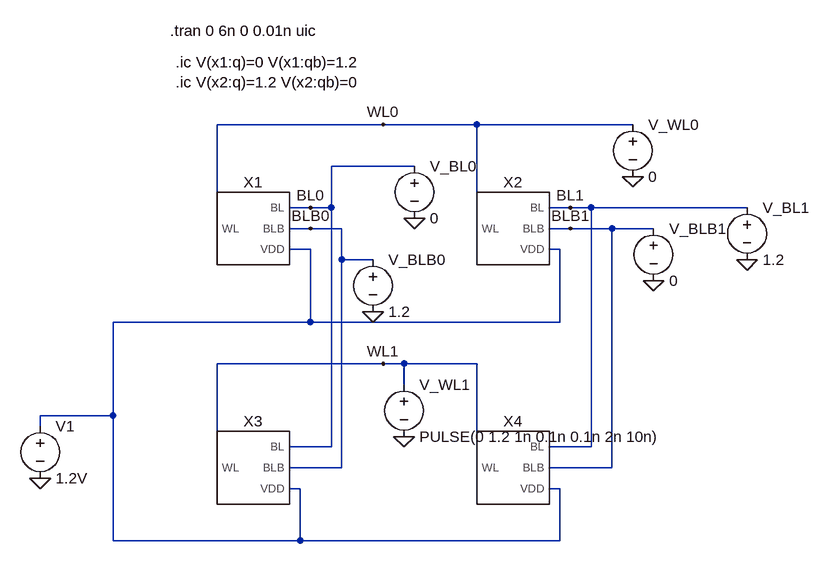
[diagram p0: schematic 2x2_SRAM_ARRAY.asc]
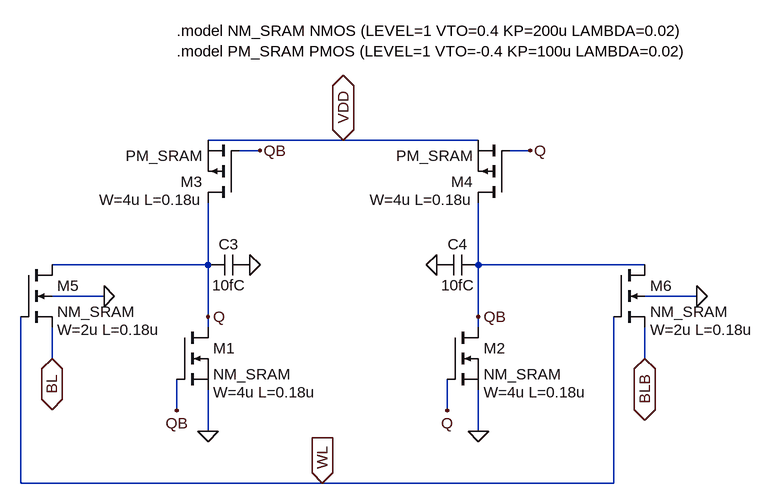
[diagram p1: sub-circuit sram_cell.asc]
2x2_SRAM_ARRAY.asc, the LTspice schematic file:
Version 4.1
SHEET 1 1124 680
WIRE 320 -32 64 -32
WIRE 464 -32 320 -32
WIRE 704 -32 464 -32
WIRE 368 32 240 32
WIRE 208 96 176 96
WIRE 240 96 240 32
WIRE 240 96 208 96
WIRE 608 96 576 96
WIRE 640 96 608 96
WIRE 880 96 640 96
WIRE 64 128 64 -32
WIRE 208 128 176 128
WIRE 256 128 208 128
WIRE 464 128 464 -32
WIRE 608 128 576 128
WIRE 672 128 608 128
WIRE 736 128 672 128
WIRE 208 160 176 160
WIRE 592 160 576 160
WIRE 256 176 256 128
WIRE 304 176 256 176
WIRE 208 272 208 160
WIRE 208 272 -96 272
WIRE 592 272 592 160
WIRE 592 272 208 272
WIRE 320 336 64 336
WIRE 352 336 320 336
WIRE 464 336 352 336
WIRE 352 368 352 336
WIRE -96 416 -96 272
WIRE -96 416 -208 416
WIRE -208 432 -208 416
WIRE 240 464 240 96
WIRE 240 464 176 464
WIRE 640 464 640 96
WIRE 640 464 576 464
WIRE 64 496 64 336
WIRE 256 496 256 176
WIRE 256 496 176 496
WIRE 464 496 464 336
WIRE 672 496 672 128
WIRE 672 496 576 496
WIRE 192 528 176 528
WIRE 592 528 576 528
WIRE -96 608 -96 416
WIRE 192 608 192 528
WIRE 192 608 -96 608
WIRE 592 608 592 528
WIRE 592 608 192 608
FLAG -208 512 0
FLAG 320 -32 WL0
FLAG 320 336 WL1
FLAG 208 96 BL0
FLAG 608 96 BL1
FLAG 208 128 BLB0
FLAG 608 128 BLB1
FLAG 704 48 0
FLAG 352 448 0
FLAG 368 112 0
FLAG 304 256 0
FLAG 736 208 0
FLAG 880 176 0
SYMBOL SRAM_Cell 112 128 R0
SYMATTR InstName X1
SYMBOL SRAM_Cell 512 128 R0
SYMATTR InstName X2
SYMBOL SRAM_Cell 112 496 R0
SYMATTR InstName X3
SYMBOL SRAM_Cell 512 496 R0
SYMATTR InstName X4
SYMBOL voltage -208 416 R0
SYMATTR InstName V1
SYMATTR Value 1.2V
SYMBOL voltage 704 -48 R0
WINDOW 123 0 0 Left 0
WINDOW 39 0 0 Left 0
SYMATTR InstName V_WL0
SYMATTR Value 0
SYMBOL voltage 352 352 R0
WINDOW 123 0 0 Left 0
WINDOW 39 0 0 Left 0
SYMATTR InstName V_WL1
SYMATTR Value PULSE(0 1.2 1n 0.1n 0.1n 2n 10n)
SYMBOL voltage 880 80 R0
SYMATTR InstName V_BL1
SYMATTR Value 1.2
SYMBOL voltage 736 112 R0
SYMATTR InstName V_BLB1
SYMATTR Value 0
SYMBOL voltage 368 16 R0
SYMATTR InstName V_BL0
SYMATTR Value 0
SYMBOL voltage 304 160 R0
SYMATTR InstName V_BLB0
SYMATTR Value 1.2
TEXT -8 -176 Left 2 !.tran 0 6n 0 0.01n uic
TEXT 0 -128 Left 2 !.ic V(x1:q)=0 V(x1:qb)=1.2\n.ic V(x2:q)=1.2 V(x2:qb)=0

sram_cell.asc, the sub-circuit schematic file:
Version 4.1
SHEET 1 3332 820
WIRE 256 -48 48 -48
WIRE 464 -48 256 -48
WIRE 128 -32 96 -32
WIRE 544 -32 512 -32
WIRE 48 144 48 48
WIRE 48 144 -192 144
WIRE 464 144 464 48
WIRE 720 144 464 144
WIRE -112 192 -192 192
WIRE 800 192 720 192
WIRE 48 224 48 144
WIRE 464 224 464 144
WIRE 48 240 48 224
WIRE 464 240 464 224
WIRE -192 288 -192 240
WIRE 720 288 720 240
WIRE 0 368 0 320
WIRE 416 368 416 320
WIRE 48 400 48 336
WIRE 464 400 464 336
WIRE -240 480 -240 224
WIRE 224 480 -240 480
WIRE 672 480 672 224
WIRE 672 480 224 480
FLAG 48 400 0
FLAG 464 400 0
FLAG 48 224 Q
FLAG 464 224 QB
FLAG 224 480 WL
IOPIN 224 480 In
FLAG -192 288 BL
IOPIN -192 288 BiDir
FLAG 720 288 BLB
IOPIN 720 288 BiDir
FLAG 400 144 0
FLAG 112 144 0
FLAG 544 -32 Q
FLAG 128 -32 QB
FLAG 416 368 Q
FLAG 0 368 QB
FLAG 256 -48 VDD
IOPIN 256 -48 BiDir
FLAG 800 192 0
FLAG -112 192 0
SYMBOL nmos 0 240 R0
WINDOW 39 56 100 Left 2
SYMATTR SpiceLine W=4u L=0.18u
SYMATTR InstName M1
SYMATTR Value NM_SRAM
SYMBOL nmos 416 240 R0
WINDOW 39 56 100 Left 2
SYMATTR SpiceLine W=4u L=0.18u
SYMATTR InstName M2
SYMATTR Value NM_SRAM
SYMBOL pmos 96 48 R180
WINDOW 39 56 4 Left 2
SYMATTR SpiceLine W=4u L=0.18u
SYMATTR InstName M3
SYMATTR Value PM_SRAM
SYMBOL pmos 512 48 R180
WINDOW 39 56 4 Left 2
SYMATTR SpiceLine W=4u L=0.18u
SYMATTR InstName M4
SYMATTR Value PM_SRAM
SYMBOL nmos4 -240 144 R0
WINDOW 39 56 100 Left 2
SYMATTR SpiceLine W=2u L=0.18u
SYMATTR InstName M5
SYMATTR Value NM_SRAM
SYMBOL nmos4 672 144 R0
WINDOW 39 56 100 Left 2
SYMATTR SpiceLine W=2u L=0.18u
SYMATTR InstName M6
SYMATTR Value NM_SRAM
SYMBOL cap 112 128 R90
WINDOW 0 0 32 VBottom 2
WINDOW 3 32 32 VTop 2
SYMATTR InstName C3
SYMATTR Value 10fC
SYMBOL cap 464 128 R90
WINDOW 0 0 32 VBottom 2
WINDOW 3 32 32 VTop 2
SYMATTR InstName C4
SYMATTR Value 10fC
TEXT 0 -216 Left 2 !.model NM_SRAM NMOS (LEVEL=1 VTO=0.4 KP=200u LAMBDA=0.02)\n.model PM_SRAM PMOS (LEVEL=1 VTO=-0.4 KP=100u LAMBDA=0.02)

The netlist it stands for:
* 2x2_SRAM_ARRAY.asc
X§X1 WL0 BL0 BLB0 N001 sram_cell
X§X2 WL0 BL1 BLB1 N001 sram_cell
X§X3 WL1 BL0 BLB0 N001 sram_cell
X§X4 WL1 BL1 BLB1 N001 sram_cell
V1 N001 0 1.2V
V_WL0 WL0 0 0
V_WL1 WL1 0 PULSE(0 1.2 1n 0.1n 0.1n 2n 10n)
V_BL1 BL1 0 1.2
V_BLB1 BLB1 0 0
V_BL0 BL0 0 0
V_BLB0 BLB0 0 1.2

* block symbol definitions
.subckt sram_cell WL BL BLB VDD
M1 Q QB 0 0 NM_SRAM W=4u L=0.18u
M2 QB Q 0 0 NM_SRAM W=4u L=0.18u
M3 Q QB VDD VDD PM_SRAM W=4u L=0.18u
M4 QB Q VDD VDD PM_SRAM W=4u L=0.18u
M5 Q WL BL 0 NM_SRAM W=2u L=0.18u
M6 QB WL BLB 0 NM_SRAM W=2u L=0.18u
C3 0 Q 10fC
C4 QB 0 10fC
.model NM_SRAM NMOS (LEVEL=1 VTO=0.4 KP=200u LAMBDA=0.02)
.model PM_SRAM PMOS (LEVEL=1 VTO=-0.4 KP=100u LAMBDA=0.02)
.ends sram_cell

.model NMOS NMOS
.model PMOS PMOS
.lib standard.mos
.tran 0 6n 0 0.01n uic
.ic V(x1:q)=0 V(x1:qb)=1.2
.ic V(x2:q)=1.2 V(x2:qb)=0
.backanno
.end